# EAGLE schematic SelfTestWiring (EAGLE 7.6.0)
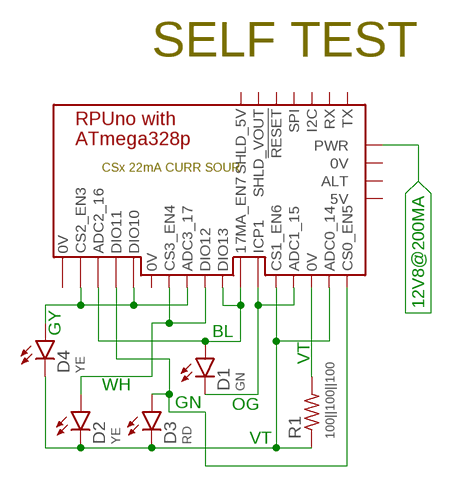
[diagram p0: schematic, sheet 1]

## Parts
BM3  RPUNO  [NA-30]
D1  GN  LED5MM  [LED5MM]
D2  YE  LED5MM  [LED5MM]
D3  RD  LED5MM  [LED5MM]
D4  YE  LED5MM  [LED5MM]
R1  100||100||100  R0805  [C0805(2012)]

## Nets
12V8@200MA: BM3.8(PWR)
BL: BM3.13(ADC2_16) BM3.18(DIO13) BM3.21(17MA_EN7) D1.A
GN: BM3.14(DIO11) BM3.23(CS0_EN5) D3.A
GY: BM3.15(DIO10) BM3.16(ADC3_17) BM3.24(CS2_EN3) D4.A
N$1: BM3.26(0V) R1.2
OG: BM3.10(ADC1_15) BM3.12(ICP1) D1.K
VT: BM3.11(ADC0_14) BM3.22(CS1_EN6) D2.K D3.K D4.K R1.1
WH: BM3.17(DIO12) BM3.29(CS3_EN4) D2.A
Unconnected: BM3.1(TX) BM3.2(RX) BM3.3(I2C) BM3.4(SPI) BM3.5(!RESET) BM3.6(SHLD_5V) BM3.7(SHLD_VOUT) BM3.9(0V) BM3.19(5V) BM3.20(ALT) BM3.27(0V) BM3.28(0V)

## Notes on the sheet
- SELF TEST

## Library data of the parts
BM3 = Documentation:RPUNO: BM /w 328p
D1-D4 = D-LED:LED: LED 120120WH [CREE,XHGAWT-00-0000-00000HXE1] LED WHITE 6500K 150LUM-W120120
R1 = R-C:R: Resiistor American-style symbol